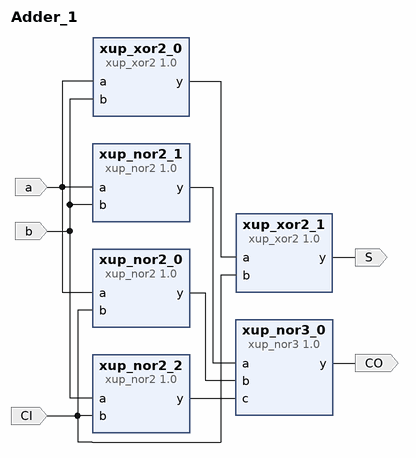
[diagram p0: block diagram of the top level]
# Vivado block design Adder_1, xc7a35tcpg236-1, Vivado 2021.1
create_bd_design Adder_1

create_bd_port -dir I a
create_bd_port -dir I b
create_bd_port -dir I CI
create_bd_port -dir O S
create_bd_port -dir O CO

create_bd_cell -type ip -vlnv xilinx.com:xup:xup_xor2:1.0 xup_xor2_0
set_property -dict {CONFIG.DELAY 0} [get_bd_cells xup_xor2_0]
create_bd_cell -type ip -vlnv xilinx.com:xup:xup_xor2:1.0 xup_xor2_1
set_property -dict {CONFIG.DELAY 0} [get_bd_cells xup_xor2_1]
create_bd_cell -type ip -vlnv xilinx.com:xup:xup_nor2:1.0 xup_nor2_0
set_property -dict {CONFIG.DELAY 0} [get_bd_cells xup_nor2_0]
create_bd_cell -type ip -vlnv xilinx.com:xup:xup_nor2:1.0 xup_nor2_1
set_property -dict {CONFIG.DELAY 0} [get_bd_cells xup_nor2_1]
create_bd_cell -type ip -vlnv xilinx.com:xup:xup_nor2:1.0 xup_nor2_2
set_property -dict {CONFIG.DELAY 0} [get_bd_cells xup_nor2_2]
create_bd_cell -type ip -vlnv xilinx.com:xup:xup_nor3:1.0 xup_nor3_0
set_property -dict {CONFIG.DELAY 0} [get_bd_cells xup_nor3_0]

# ---- connections ----

connect_bd_net [get_bd_ports a] [get_bd_pins xup_xor2_0/a] [get_bd_pins xup_nor2_1/a] [get_bd_pins xup_nor2_0/a]
connect_bd_net [get_bd_ports b] [get_bd_pins xup_xor2_0/b] [get_bd_pins xup_nor2_1/b] [get_bd_pins xup_nor2_2/a]
connect_bd_net -net c_1 [get_bd_ports CI] [get_bd_pins xup_xor2_1/b] [get_bd_pins xup_nor2_0/b] [get_bd_pins xup_nor2_2/b]
connect_bd_net [get_bd_pins xup_nor2_0/y] [get_bd_pins xup_nor3_0/b]
connect_bd_net [get_bd_pins xup_nor2_1/y] [get_bd_pins xup_nor3_0/a]
connect_bd_net [get_bd_pins xup_nor2_2/y] [get_bd_pins xup_nor3_0/c]
connect_bd_net [get_bd_pins xup_nor3_0/y] [get_bd_ports CO]
connect_bd_net [get_bd_pins xup_xor2_0/y] [get_bd_pins xup_xor2_1/a]
connect_bd_net [get_bd_pins xup_xor2_1/y] [get_bd_ports S]

validate_bd_design
save_bd_design
